# Altium schematic sheet 5V_BOOST.SchDoc
size A; SheetNumber: 8; SheetTotal: 9
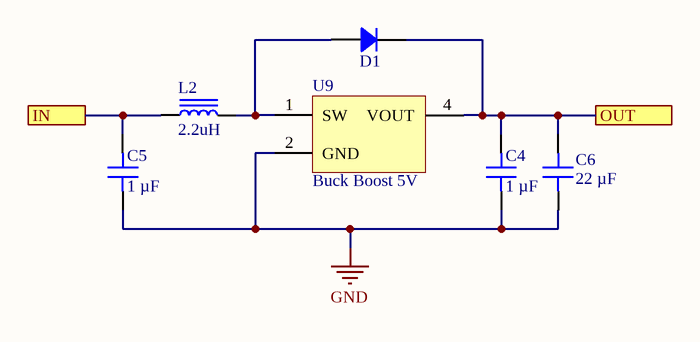
[diagram p0: 5V_BOOST.SchDoc]

## Parts
C4  1 µF  [CAP 0402_1005]
C5  1 µF  [CAP 0402_1005]
C6  22 µF  [CAP 0805_2012]
D1  V1F6-M3/H  [SMF DO-219AB]  (value not drawn)
L2  2.2uH  [TAIYO YUDEN MAMK2520T1R0M]
U9  Buck Boost 5V  [TI SOT-23-5 DBV]

## Ports
IN, OUT

## Nets
GND: C4.1 C5.1 C6.1 U9.2(GND)
IN: C5.2 L2.1 ; port IN
OUT: C4.2 C6.2 D1.2 U9.4(VOUT) ; port OUT
NetD1_1: D1.1 L2.2 U9.1(SW)

## Library data of the parts
C4 C5 = C0402C104K4RACAUTO: CAP CER 0.1UF 16V X7R 0402; manufacturer: KEMET; Capacitance: 0.1 µF; Tolerance: ±10%; Part Number: C0402C104K4RACAUTO; Value: 1 µF; Applications: Automotive, Bypass, Decoupling; componentlink1description: Datasheet; componentlink1url: https://api.kemet.com/component-edge/download/specsheet/C0402C104K4RACAUTO.pdf; componentlink2description: DigiKey Link; componentlink2url: https://www.digikey.com/en/products/detail/kemet/C0402C104K4RACAUTO/3314827; Device Package: 0402 (1005 Metric); lastupdated: 8/14/2022 9:05:51 PM; Lifecycle Status: Active; Minimum Order: 1; Mounting Type: Surface Mount, MLCC; Operating Temperature: -55°C ~ 125°C; Package / Case: 0402 (1005 Metric); packaging: TapeAndReel; partid: 3024; Part Status: Active; price: 0.01; Ratings: AEC-Q200; series: SMD Auto X7R; Size / Dimension: 0.039" L x 0.020" W (1.00mm x 0.50mm); Supplier 1: DigiKey; Supplier Part Number 1: 399-6828-1-ND; Temperature Coefficient: X7R; Thickness (Max): 0.022" (0.55mm); Voltage - Rated: 16V
C6 = GRM21BC81A226ME44L: CAP CER 22UF 10V X6S 0805; manufacturer: Murata Electronics; Tolerance: ±20%; Part Number: GRM21BC81A226ME44L; Value: 22 µF; Applications: General Purpose; Capacitance: 22 µF; componentlink1description: Datasheet; componentlink1url: https://search.murata.co.jp/Ceramy/image/img/A01X/G101/ENG/GRM21BC81A226ME44-01.pdf; componentlink2description: DigiKey Link; componentlink2url: https://www.digikey.com/en/products/detail/murata-electronics/GRM21BC81A226ME44L/4905507; Device Package: 0805 (2012 Metric); lastupdated: 9/19/2022 1:04:08 PM; Lifecycle Status: Active; Minimum Order: 1; Mounting Type: Surface Mount, MLCC; Operating Temperature: -55°C ~ 105°C; Package / Case: 0805 (2012 Metric); packaging: TapeAndReel; partid: 10035; Part Status: Active; price: 0.10; series: GRM; Size / Dimension: 0.079" L x 0.049" W (2.00mm x 1.25mm); Supplier 1: DigiKey; Supplier Part Number 1: 490-14657-1-ND; Temperature Coefficient: X6S; Thickness (Max): 0.057" (1.45mm); Voltage - Rated: 10V
D1 = V1F6-M3/H: 1A 60V SMF TRENCH SKY RECT; Manufacturer: Vishay Semiconductor Diodes Division; Capacitance @ Vr, F: 135pF @ 4V, 1MHz; Current - Reverse Leakage @ Vr: 270µA @ 60V; Diode Type: Schottky; Speed: Fast Recovery =< 500ns, > 200mA (Io); Voltage - Forward (Vf) (Max) @ If: 600mV @ 1A; Part Number: V1F6-M3/H; ComponentLink1Description: Datasheet; ComponentLink1URL: http://www.vishay.com/docs/87555/v1f6.pdf; ComponentLink2Description: DigiKey Link; ComponentLink2URL: http://digikey.com/product-detail/en/vishay-semiconductor-diodes-division/V1F6-M3-H/112-V1F6-M3-HCT-ND/10660586; Current - Average Rectified (Io): 1A; LastUpdated: 02-Sep-20 1:23:13 AM; Lifecycle Status: Active; Minimum Order: 1; Mounting Type: Surface Mount; Operating Temperature - Junction: -40°C ~ 150°C; Package / Case: DO-219AB; Packaging: Unknown; PartId: 3272; Part Status: Active; Price: 0.07; Series: eSMP®, TMBS®; Supplier 1: DigiKey; Supplier Part Number 1: 112-V1F6-M3/HCT-ND; Supplier Device Package: DO-219AB (SMF); Voltage - DC Reverse (Vr) (Max): 60V
L2 = MAKK2520TR47M: FIXED IND 470NH 3.2A 46 MOHM SMD; Manufacturer: Taiyo Yuden; Current - Saturation: 3.9A; DC Resistance (DCR): 46mOhm Max; Inductance Frequency - Test: 2MHz; Material - Core: Metal; Shielding: Shielded; Tolerance: ±20%; Type: Wirewound; Part Number: MAKK2520TR47M; ComponentLink1Description: Datasheet; ComponentLink1URL: https://ds.yuden.co.jp/TYCOMPAS/ut/detail?pn=MAKK2520TR47M  &u=M; ComponentLink2Description: DigiKey Link; ComponentLink2URL: http://digikey.com/product-detail/en/taiyo-yuden/MAKK2520TR47M/587-4145-1-ND/5035305; Current Rating (Amps): 3.2A; Device Package: 1008 (2520 Metric); Height - Seated (Max): 0.039" (1.00mm); Inductance: 470nH; LastUpdated: 9/2/2020 1:22:11 AM; Lifecycle Status: Active; Minimum Order: 1; Mounting Type: Surface Mount; Operating Temperature: -40°C ~ 105°C; Package / Case: 1008 (2520 Metric); Packaging: TapeAndReel; PartId: 69; Part Status: Active; Price: 0.09; Series: MCOIL™, MA; Size / Dimension: 0.098" L x 0.079" W (2.50mm x 2.00mm); Supplier 1: DigiKey; Supplier Part Number 1: 587-4145-1-ND; Supplier Device Package: 1008 (2520 Metric); Value: 470nH
U9 = TPS613222A: ADJ step down Buck